# Altium schematic sheet PHY_Demo.SchDoc: NanoBoard Ethernet Add-On
size C; DocumentNumber: 1; SheetNumber: 1; SheetTotal: 1
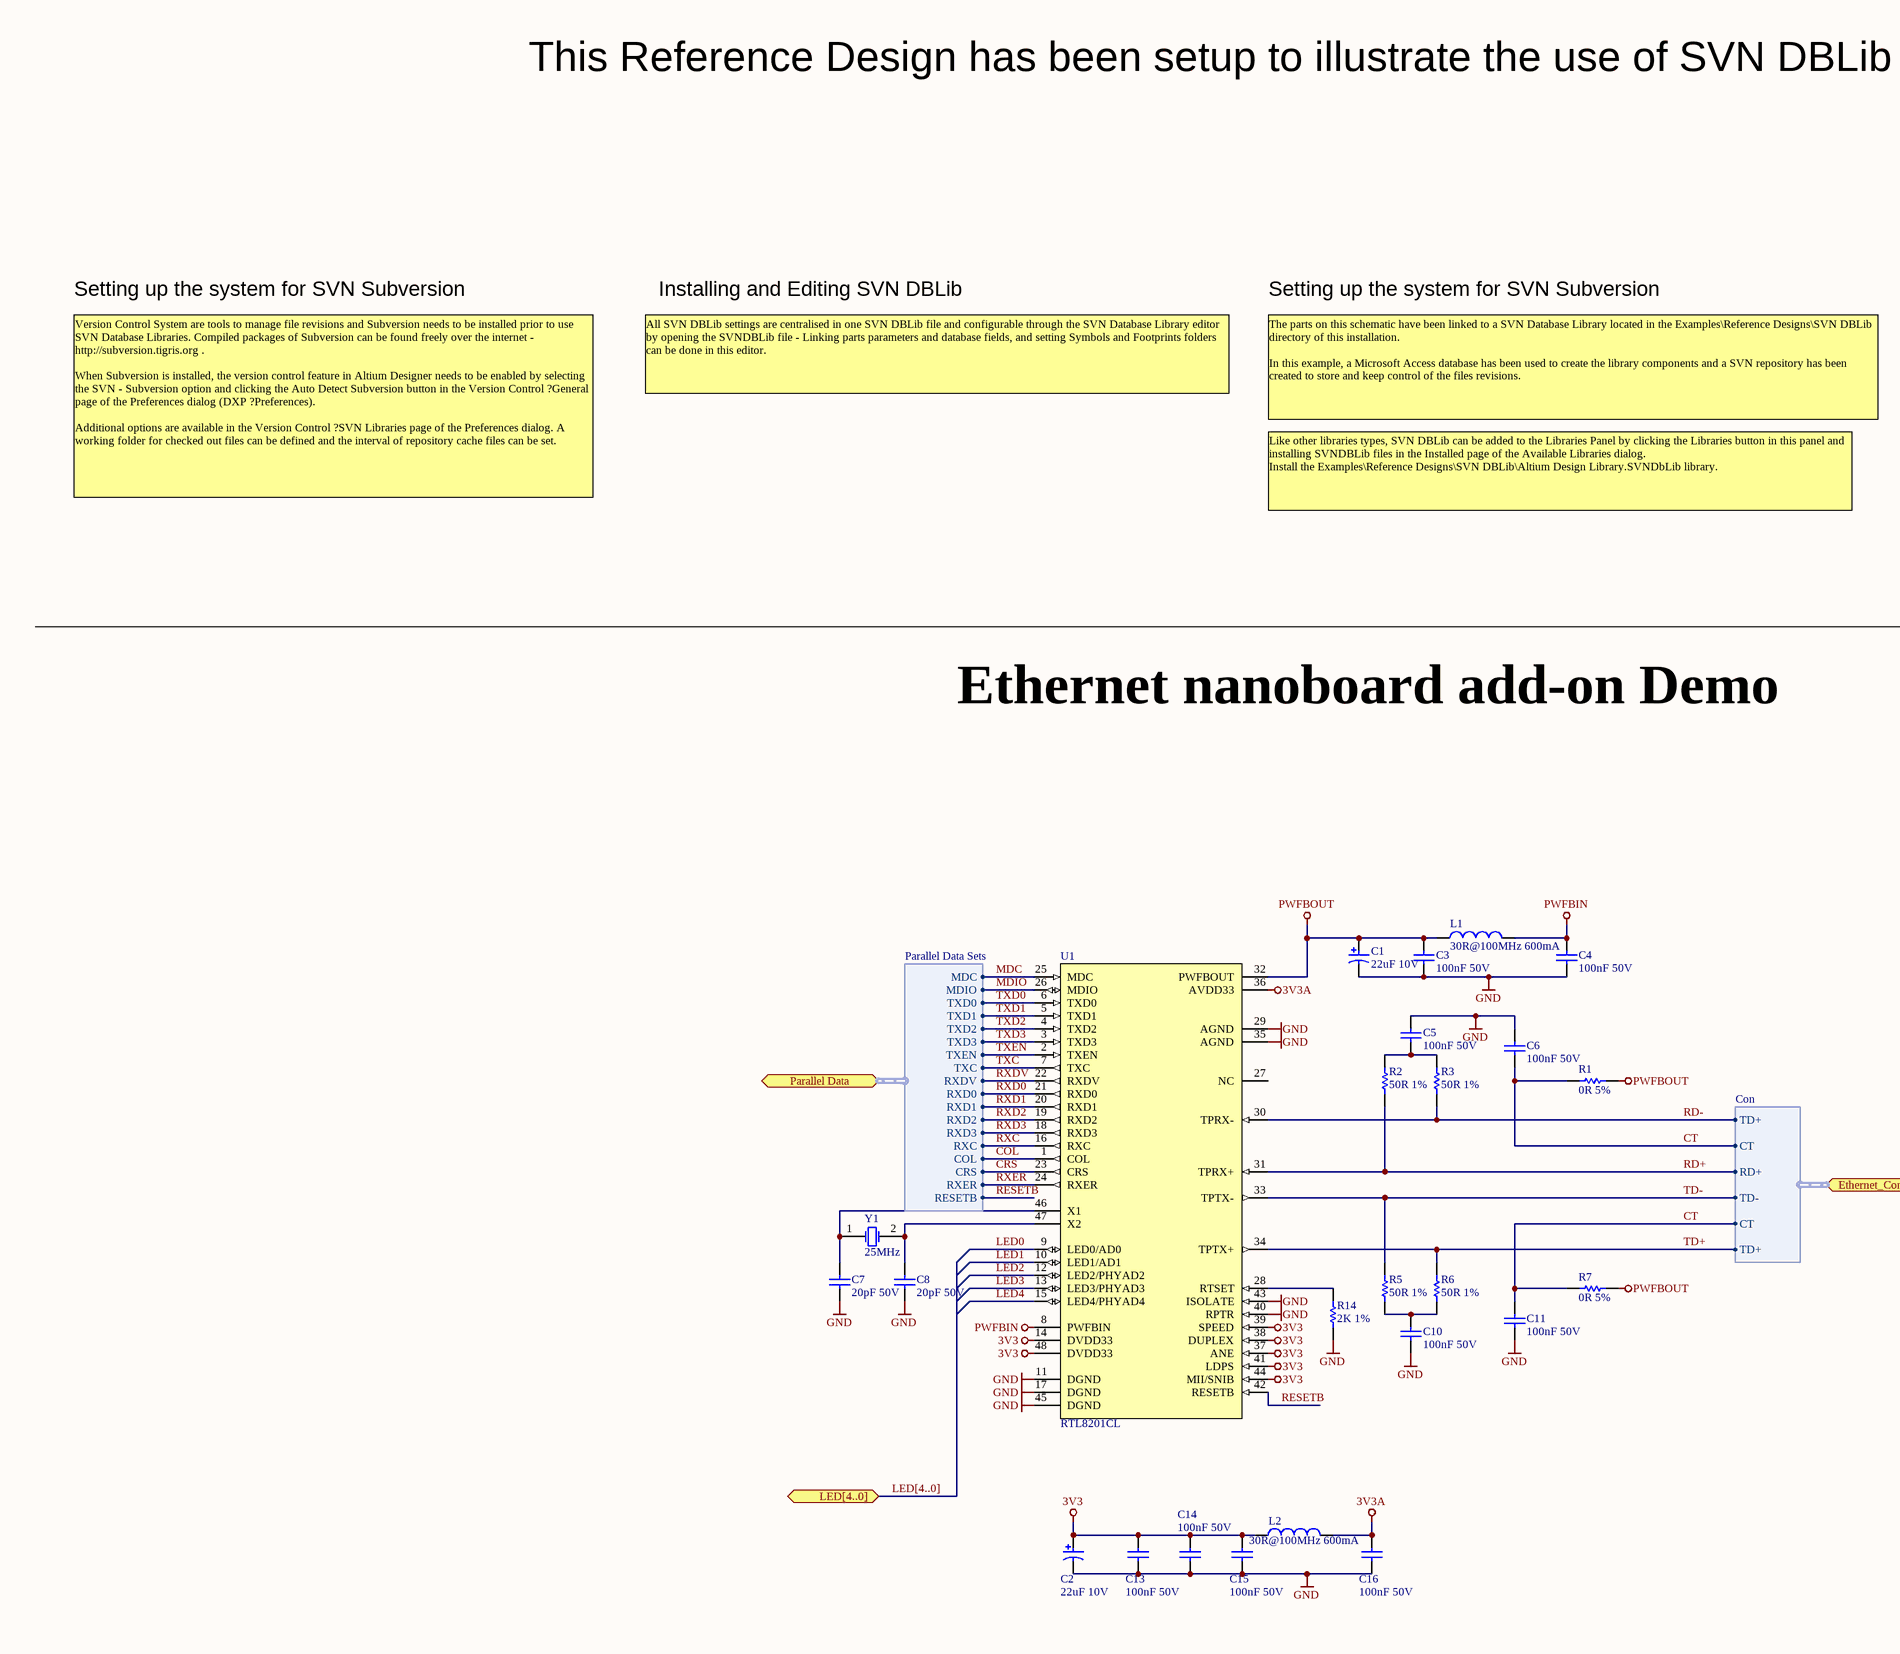
[diagram p0: PHY_Demo.SchDoc, left]
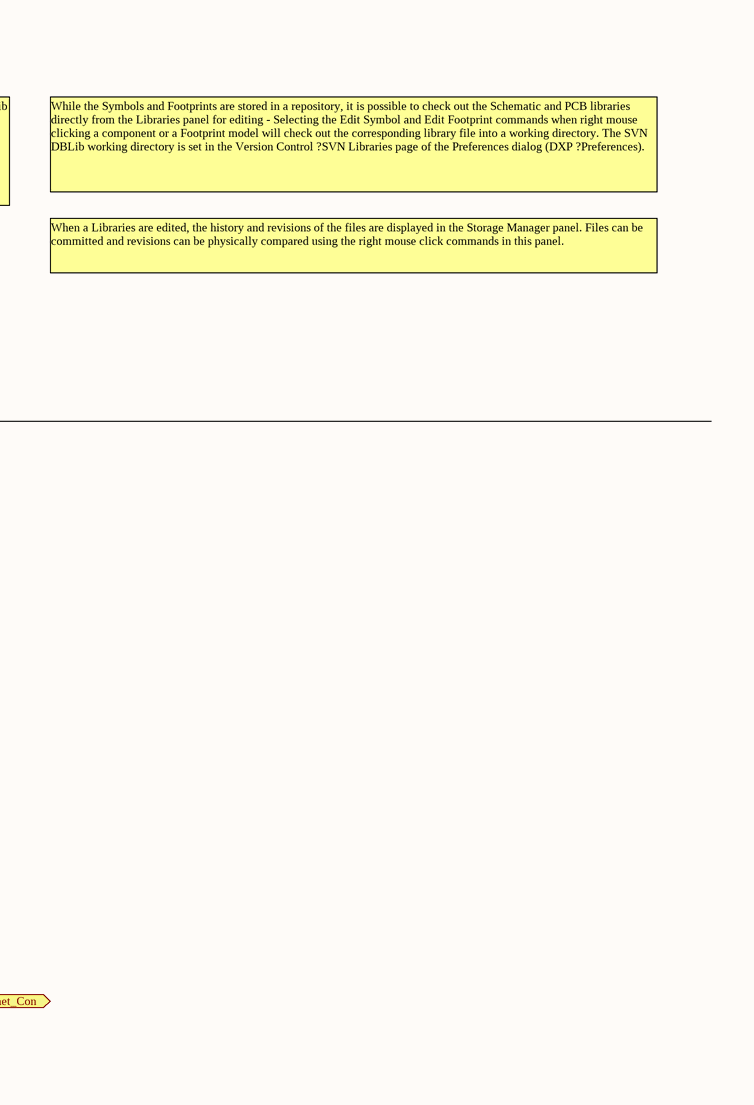
[diagram p1: PHY_Demo.SchDoc, right]

## Parts
C1  22uF 10V  [CAPC3528]
C2  22uF 10V  [CAPC3528]
C3  100nF 50V  [CAPC2012]
C4  100nF 50V  [CAPC2012]
C5  100nF 50V  [CAPC2012]
C6  100nF 50V  [CAPC2012]
C7  20pF 50V  [CAPC2012]
C8  20pF 50V  [CAPC2012]
C10  100nF 50V  [CAPC2012]
C11  100nF 50V  [CAPC2012]
C13  100nF 50V  [CAPC2012]
C14  100nF 50V  [CAPC2012]
C15  100nF 50V  [CAPC2012]
C16  100nF 50V  [CAPC2012]
L1  30R@100MHz 600mA  [INDC2012]
L2  30R@100MHz 600mA  [INDC2012]
R1  0R 5%  [RESC2012]
R2  50R 1%  [RESC2012]
R3  50R 1%  [RESC2012]
R5  50R 1%  [RESC2012]
R6  50R 1%  [RESC2012]
R7  0R 5%  [RESC2012]
R14  2K 1%  [RESC2012]
U1  RTL8201CL  [TSQFP50P900X900-48]
Y1  25MHz  [XTAL_HC49SMD 20Mhz  +/-30ppm 20pf]

## Ports
Ethernet_Con (harness Con), LED[4..0] (bidir), Parallel Data (harness Parallel Data Sets)

## Harnesses
Parallel Data Sets: MDC, MDIO, TXD0, TXD1, TXD2, TXD3, TXEN, TXC, RXDV, RXD0, RXD1, RXD2, RXD3, RXC, COL, CRS, RXER, RESETB
Con: TD+, CT, RD+, TD-, CT, TD+

## Nets
3V3: C2.1 C13.2 C14.2 C15.2 L2.1 U1.14(DVDD33) U1.37(ANE) U1.38(DUPLEX) U1.39(SPEED) U1.41(LDPS) U1.44(MII/SNIB) U1.48(DVDD33)
3V3A: C16.2 L2.2 U1.36(AVDD33)
GND: C1.2 C2.2 C3.1 C4.1 C5.2 C6.1 C7.1 C8.1 C10.1 C11.1 C13.1 C14.1 C15.1 C16.1 R14.1 U1.11(DGND) U1.17(DGND) U1.29(AGND) U1.35(AGND) U1.40(RPTR) U1.43(ISOLATE) U1.45(DGND)
PWFBIN: C4.2 L1.2 U1.8(PWFBIN)
PWFBOUT: C1.1 C3.2 L1.1 R1.2 R7.2 U1.32(PWFBOUT)
COL: U1.1(COL) ; port Parallel Data.COL
CRS: U1.23(CRS) ; port Parallel Data.CRS
CT: C6.2 C11.2 R1.1 R7.1 ; port Ethernet_Con.CT
LED0: U1.9(LED0/AD0)
LED1: U1.10(LED1/AD1)
LED2: U1.12(LED2/PHYAD2)
LED3: U1.13(LED3/PHYAD3)
LED4: U1.15(LED4/PHYAD4)
MDC: U1.25(MDC) ; port Parallel Data.MDC
MDIO: U1.26(MDIO) ; port Parallel Data.MDIO
RD+: R2.1 U1.31(TPRX+) ; port Ethernet_Con.RD+
RD-: R3.1 R6.2 U1.30(TPRX-) U1.34(TPTX+) ; port Ethernet_Con.TD+  [also labelled TD+]
RESETB: U1.42(RESETB) ; port Parallel Data.RESETB
RXC: U1.16(RXC) ; port Parallel Data.RXC
RXD0: U1.21(RXD0) ; port Parallel Data.RXD0
RXD1: U1.20(RXD1) ; port Parallel Data.RXD1
RXD2: U1.19(RXD2) ; port Parallel Data.RXD2
RXD3: U1.18(RXD3) ; port Parallel Data.RXD3
RXDV: U1.22(RXDV) ; port Parallel Data.RXDV
RXER: U1.24(RXER) ; port Parallel Data.RXER
TD-: R5.2 U1.33(TPTX-) ; port Ethernet_Con.TD-
TXC: U1.7(TXC) ; port Parallel Data.TXC
TXD0: U1.6(TXD0) ; port Parallel Data.TXD0
TXD1: U1.5(TXD1) ; port Parallel Data.TXD1
TXD2: U1.4(TXD2) ; port Parallel Data.TXD2
TXD3: U1.3(TXD3) ; port Parallel Data.TXD3
TXEN: U1.2(TXEN) ; port Parallel Data.TXEN
NetC5_1: C5.1 R2.2 R3.2
NetC7_2: C7.2 U1.46(X1) Y1.1(OSC1)
NetC8_2: C8.2 U1.47(X2) Y1.2(OSC2)
NetC10_2: C10.2 R5.1 R6.1
NetR14_2: R14.2 U1.28(RTSET)

Not connected (* = marked no-connect by the designer): U1 27(NC)

## Buses and harness runs
bus LED[4..0] = port LED[4..0]

## Notes on the sheet
- This Reference Design has been setup to illustrate the use of SVN DBLib in Altium Designer.
- Setting up the system for SVN Subversion
- Installing and Editing SVN DBLib
- All SVN DBLib settings are centralised in one SVN DBLib file and configurable through the SVN Database Library editor by opening the SVNDBLib file - Linking parts parameters and database fields, and setting Symbols and Footprints folders can be done in this editor.
- The parts on this schematic have been linked to a SVN Database Library located in the Examples\Reference Designs\SVN DBLib directory of this installation.
  In this example, a Microsoft Access database has been used to create the library components and a SVN repository has been created to store and keep control of the files revisions.
- While the Symbols and Footprints are stored in a repository, it is possible to check out the Schematic and PCB libraries directly from the Libraries panel for editing - Selecting the Edit Symbol and Edit Footprint commands when right mouse clicking a component or a Footprint model will check out the corresponding library file into a working directory. The SVN DBLib working directory is set in the Version Control ?SVN Libraries page of the Preferences dialog (DXP ?Preferences).
- Version Control System are tools to manage file revisions and Subversion needs to be installed prior to use SVN Database Libraries. Compiled packages of Subversion can be found freely over the internet - http://subversion.tigris.org .
  When Subversion is installed, the version control feature in Altium Designer needs to be enabled by selecting the SVN - Subversion option and clicking the Auto Detect Subversion button in the Version Control ?General page of the Preferences dialog (DXP ?Preferences).
  Additional options are available in the Version Control ?SVN Libraries page of the Preferences dialog. A working folder for checked out files can be defined and the interval of repository cache files can be set.
- When a Libraries are edited, the history and revisions of the files are displayed in the Storage Manager panel. Files can be committed and revisions can be physically compared using the right mouse click commands in this panel.
- Like other libraries types, SVN DBLib can be added to the Libraries Panel by clicking the Libraries button in this panel and installing SVNDBLib files in the Installed page of the Available Libraries dialog.
  Install the Examples\Reference Designs\SVN DBLib\Altium Design Library.SVNDbLib library.
- Ethernet nanoboard add-on Demo
- Title
- Size:
- Date:
- File:
- C
- Number:
- Time:
- Revision:
- Sheet
- of

## Library data of the parts
C1 C2 = CAP-P: Polar Capacitor; Design Item Id: CAP-P-22uF-10V-MCCT-B
C3-C8 C10 C11 C13-C16 = CAP-NP: Capacitor
  C3-C6 C10 C11 C13-C16: Design Item Id: CAP-NP-100nF-50V-0805
  C7 C8: Design Item Id: CAP-NP-20pF-50V-0805
L1 L2 = IND-FER: Ferrite Bead; Design Item Id: IND-FER-30R@100MHz-600mA
R1-R3 R5-R7 R14 = RES: Resistor
  R1 R7: Design Item Id: RES-0R-0805
  R2 R3 R5 R6: Design Item Id: RES-50R-1%-0805
  R14: Design Item Id: RES-2K-1%-0805
U1 = RTL8201CL: Realtek Ethernet PHY tranceiver; Design Item Id: RTL8201CL
Y1 = CRYS: Surface Mount Crystal; Design Item Id: CRYS-25MHz-QC49